# Altium schematic sheet PCB_tete_v1.SchDoc
size A4
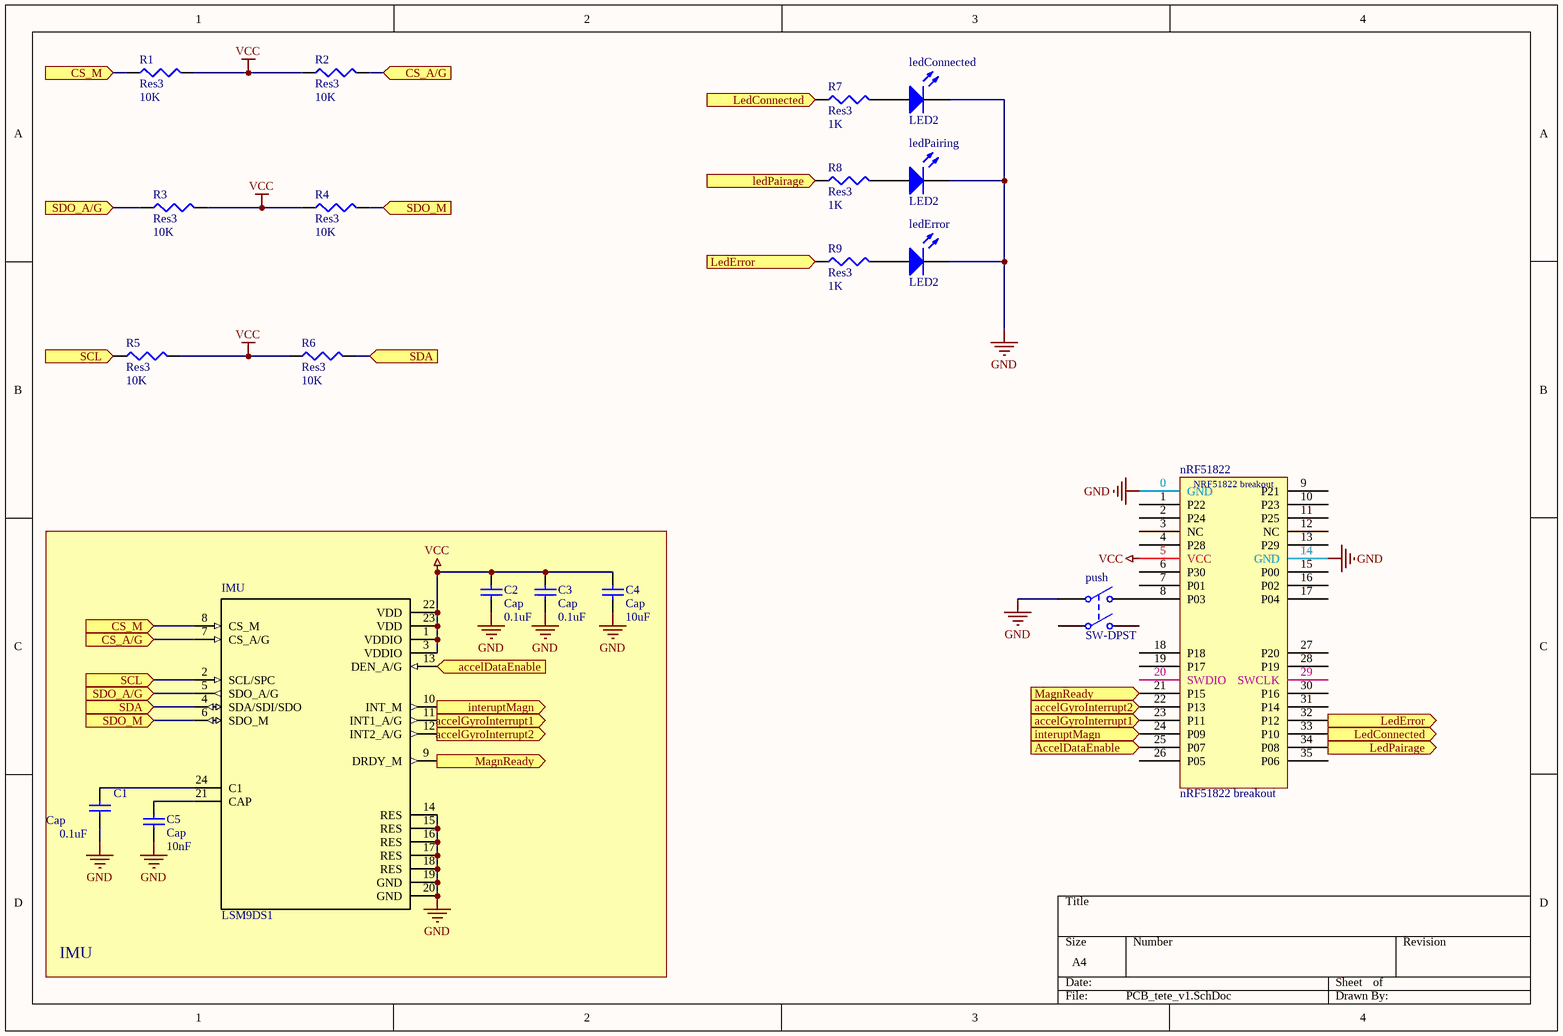
[diagram p0: PCB_tete_v1.SchDoc]

## Parts
C1  Cap  value 0.1uF  [0402]
C2  Cap  value 0.1uF  [0402]
C3  Cap  value 0.1uF  [0402]
C4  Cap  value 10uF  [0402]
C5  Cap  value 10nF  [0402]
IMU  LSM9DS1  [PQFN24P43_350X300X102L35X23N]
ledConnected  LED2  [3.2X1.6X1.1]
ledError  LED2  [3.2X1.6X1.1]
ledPairing  LED2  [3.2X1.6X1.1]
nRF51822  nRF51822 breakout  [nrf551822_breakout]
push  SW-DPST  [DPST-4]
R1  Res3  value 10K  [J1-0603]
R2  Res3  value 10K  [J1-0603]
R3  Res3  value 10K  [J1-0603]
R4  Res3  value 10K  [J1-0603]
R5  Res3  value 10K  [J1-0603]
R6  Res3  value 10K  [J1-0603]
R7  Res3  value 1K  [J1-0603]
R8  Res3  value 1K  [J1-0603]
R9  Res3  value 1K  [J1-0603]

## Blocks framed on the sheet
IMU: C1-C5 IMU

## Ports
accelDataEnable, AccelDataEnable, accelGyroInterrupt1, accelGyroInterrupt2, CS_A/G, CS_M, interuptMagn, LedConnected, LedError, ledPairage, LedPairage, MagnReady, SCL, SDA, SDO_A/G, SDO_M

## Nets
GND: C1.1 C2.1 C3.1 C4.1 C5.1 IMU.14(RES) IMU.15(RES) IMU.16(RES) IMU.17(RES) IMU.18(RES) IMU.19(GND) IMU.20(GND) ledConnected.2(K) ledError.2(K) ledPairing.2(K) nRF51822.0(GND) nRF51822.14(GND) push.1(COMMON1)
VCC: C2.2 C3.2 C4.2 IMU.1(VDDIO) IMU.3(VDDIO) IMU.22(VDD) IMU.23(VDD) nRF51822.5(VCC) R1.2 R2.1 R3.2 R4.1 R5.2 R6.1
accelDataEnable: IMU.13(DEN_A/G) nRF51822.25(P07) ; port accelDataEnable, port AccelDataEnable
accelGyroInterrupt1: IMU.11(INT1_A/G) nRF51822.23(P11) ; port accelGyroInterrupt1
accelGyroInterrupt2: IMU.12(INT2_A/G) nRF51822.22(P13) ; port accelGyroInterrupt2
CS_A/G: IMU.7(CS_A/G) R2.2 ; port CS_A/G
CS_M: IMU.8(CS_M) R1.1 ; port CS_M
interuptMagn: IMU.10(INT_M) nRF51822.24(P09) ; port interuptMagn
LedConnected: nRF51822.33(P10) R7.1 ; port LedConnected
LedError: nRF51822.32(P12) R9.1 ; port LedError
ledPairage: nRF51822.34(P08) R8.1 ; port ledPairage, port LedPairage
MagnReady: IMU.9(DRDY_M) nRF51822.21(P15) ; port MagnReady
SCL: IMU.2(SCL/SPC) R5.1 ; port SCL
SDA: IMU.4(SDA/SDI/SDO) R6.2 ; port SDA
SDO_A/G: IMU.5(SDO_A/G) R3.1 ; port SDO_A/G
SDO_M: IMU.6(SDO_M) R4.2 ; port SDO_M
NetC1_2: C1.2 IMU.24(C1)
NetC5_2: C5.2 IMU.21(CAP)
NetledConnected_1: ledConnected.1(A) R7.2
NetledError_1: ledError.1(A) R9.2
NetledPairing_1: ledPairing.1(A) R8.2
NetnRF51822_8: nRF51822.8(P03) push.2(NO1)

Not connected (* = marked no-connect by the designer): nRF51822 1(P22) 2(P24) 3(NC) 4(P28) 6(P30) 7(P01) 9(P21) 10(P23) 11(P25) 12(NC) 13(P29) 15(P00) 16(P02) 17(P04) 18(P18) 19(P17) 20(SWDIO) 26(P05) 27(P20) 28(P19) 29(SWCLK) 30(P16) 31(P14) 35(P06); push 3(COMMON2) 4(NO2)

## Notes on the sheet
- (in symbol nRF51822 breakout) NRF51822 breakout

## Library data of the parts
C1-C5 = Cap Semi: Capacitor (Semiconductor SIM Model); Published: 8-Jun-2000; LatestRevisionDate: 29-May-2009; LatestRevisionNote: IPC-7351 Footprint Added.; PackageReference: C1206; Publisher: Altium Limited; PackageDescription: Chip Capacitor
IMU = LSM9DS1: iNEMO inertial module: 3D accelerometer, 3D gyroscope, 3D magnetometer; MF: STMicroelectronics; Price: None; Availability: Unavailable; Package: None; MP: LSM9DS1; Value: *
ledConnected ledError ledPairing = LED2: Typical RED, GREEN, YELLOW, AMBER GaAs LED; Published: 8-Jun-2000; LatestRevisionDate: 17-Jul-2002; LatestRevisionNote: Re-released for DXP Platform.; PackageVersion: Feb-2002; PackageReference: 3.2X1.6X1.1; Publisher: Altium Limited; PackageDescription: SM LED; 2 Flat Leads
push = SW-DPST: Double-Pole, Single-Throw Switch; Published: 24-Mar-1999; LatestRevisionDate: 17-Jul-2002; LatestRevisionNote: Re-released for DXP Platform.; PackageReference: DPST-4; Publisher: Altium Limited; PackageDescription: Switch; 4 Leads
R1-R9 = Res3: Resistor; Published: 8-Jun-2000; LatestRevisionDate: 29-May-2009; LatestRevisionNote: IPC-7351 Footprint Added.; PackageReference: J1-0603; Publisher: Altium Limited; PackageDescription: Chip Resistor